# Altium project Project_esp32_kit.PrjPCB
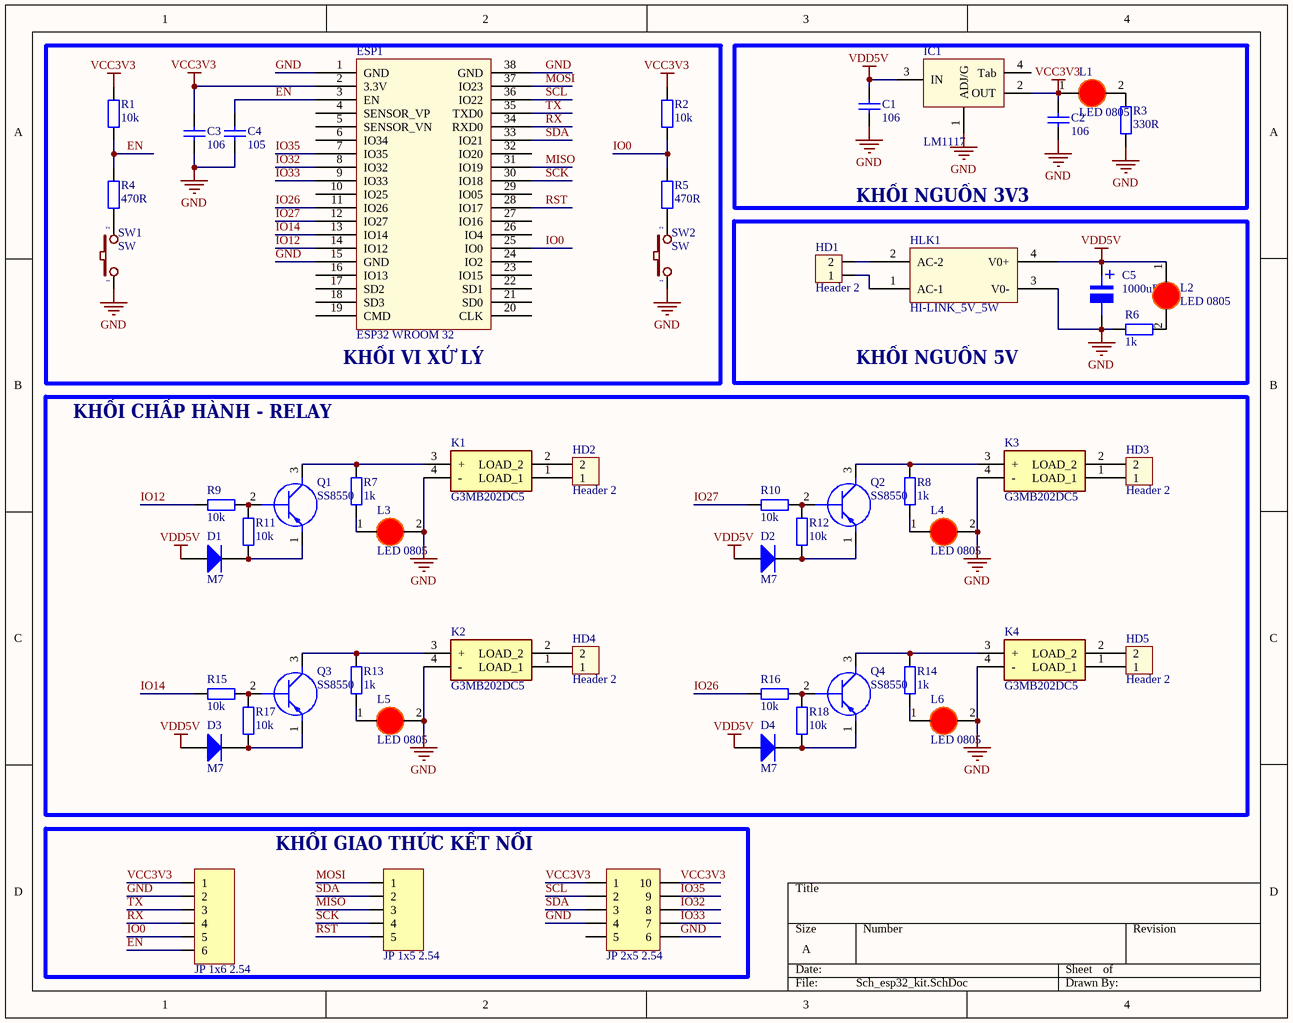
[diagram p0: Sch_esp32_kit.SchDoc]
1 sheet, 54 parts. Net scope: global (net labels, ports and power ports of the same name join across sheets).
Board file: PCB_esp32_kit.PcbDoc

## Sheet Sch_esp32_kit.SchDoc
size A

### Parts
C1  106  [tu 0603]
C2  106  [tu 0603]
C3  106  [tu 0603]
C4  105  [tu 0603]
C5  1000uF  [tu nhom 10 (G)]
D1  M7  [DIODE SMA]
D2  M7  [DIODE SMA]
D3  M7  [DIODE SMA]
D4  M7  [DIODE SMA]
ESP1  ESP32 WROOM 32  [ESP32-WROOM-32D]
HD1  Header 2  [HED2]
HD2  Header 2  [HED2]
HD3  Header 2  [HED2]
HD4  Header 2  [HED2]
HD5  Header 2  [HED2]
HLK1  HI-LINK_5V_5W  [HLK10M05]
IC1  LM1117  [SOT223-4N]
JP1  JP 1x6 2.54  [JP 1x6 DT]
JP2  JP 1x5 2.54  [JP 1x5 DT]
JP3  JP 2x5 2.54  [JP 2x5 DT]
K1  G3MB202DC5  [G3MC-201PL]
K2  G3MB202DC5  [G3MC-201PL]
K3  G3MB202DC5  [G3MC-201PL]
K4  G3MB202DC5  [G3MC-201PL]
L1  LED 0805  [LED-0805-Red]
L2  LED 0805  [LED-0805-Red]
L3  LED 0805  [LED-0805-Red]
L4  LED 0805  [LED-0805-Red]
L5  LED 0805  [LED-0805-Red]
L6  LED 0805  [LED-0805-Red]
Q1  SS8550  [SS8550]
Q2  SS8550  [SS8550]
Q3  SS8550  [SS8550]
Q4  SS8550  [SS8550]
R1  10k  [tro smd 0603]
R2  10k  [tro smd 0603]
R3  330R  [tro smd 0603]
R4  470R  [tro smd 0603]
R5  470R  [tro smd 0603]
R6  1k  [tro smd 0603]
R7  1k  [tro smd 0603]
R8  1k  [tro smd 0603]
R9  10k  [tro smd 0603]
R10  10k  [tro smd 0603]
R11  10k  [tro smd 0603]
R12  10k  [tro smd 0603]
R13  1k  [tro smd 0603]
R14  1k  [tro smd 0603]
R15  10k  [tro smd 0603]
R16  10k  [tro smd 0603]
R17  10k  [tro smd 0603]
R18  10k  [tro smd 0603]
SW1  SW  [SW1-SMD]
SW2  SW  [SW1-SMD]

### Blocks framed on the sheet
KHỐI VI XỬ LÝ: C3 C4 ESP1 R1 R2 R4 R5 SW1 SW2
KHỐI NGUỒN 3V3: C1 C2 IC1 L1 R3
KHỐI NGUỒN 5V: C5 HD1 HLK1 L2 R6
KHỐI CHẤP HÀNH - RELAY: D1-D4 HD2-HD5 K1-K4 L3-L6 Q1-Q4 R7-R18
KHỐI GIAO THỨC KẾT NỐI: JP1-JP3

### Nets
GND: C1.2 C2.2 C3.2 C4.2 C5.2 ESP1.1(GND) ESP1.15(GND) ESP1.38(GND) HLK1.3(V0-) IC1.1(ADJ/G) JP1.2 JP3.4 JP3.6 K1.4(-) K2.4(-) K3.4(-) K4.4(-) L3.2(K) L4.2(K) L5.2(K) L6.2(K) R3.1 R6.1 SW1.1 SW2.1
VCC3V3: C2.1 C3.1 ESP1.2(3.3V) IC1.2(OUT) JP1.1 JP3.1 JP3.10 L1.1(A) R1.2 R2.2
VDD5V: C1.1 C5.1 D1.1(A) D2.1(A) D3.1(A) D4.1(A) HLK1.4(V0+) IC1.3(IN) L2.1(A)
EN: C4.1 ESP1.3(EN) JP1.6 R1.1 R4.2
IO0: ESP1.25(IO0) JP1.5 R2.1 R5.2
IO12: ESP1.14(IO12) R9.2
IO14: ESP1.13(IO14) R15.2
IO26: ESP1.11(IO26) R16.2
IO27: ESP1.12(IO27) R10.2
IO32: ESP1.8(IO32) JP3.8
IO33: ESP1.9(IO33) JP3.7
IO35: ESP1.7(IO35) JP3.9
MISO: ESP1.31(IO19) JP2.3
MOSI: ESP1.37(IO23) JP2.1
RST: ESP1.28(IO17) JP2.5
RX: ESP1.34(RXD0) JP1.4
SCK: ESP1.30(IO18) JP2.4
SCL: ESP1.36(IO22) JP3.2
SDA: ESP1.33(IO21) JP2.2 JP3.3
TX: ESP1.35(TXD0) JP1.3
NetD1_2: D1.2(K) Q1.1(E) R11.1
NetD2_2: D2.2(K) Q2.1(E) R12.1
NetD3_2: D3.2(K) Q3.1(E) R17.1
NetD4_2: D4.2(K) Q4.1(E) R18.1
NetHD1_1: HD1.1 HLK1.1(AC-1)
NetHD1_2: HD1.2 HLK1.2(AC-2)
NetHD2_1: HD2.1 K1.1(LOAD_1)
NetHD2_2: HD2.2 K1.2(LOAD_2)
NetHD3_1: HD3.1 K3.1(LOAD_1)
NetHD3_2: HD3.2 K3.2(LOAD_2)
NetHD4_1: HD4.1 K2.1(LOAD_1)
NetHD4_2: HD4.2 K2.2(LOAD_2)
NetHD5_1: HD5.1 K4.1(LOAD_1)
NetHD5_2: HD5.2 K4.2(LOAD_2)
NetK1_3: K1.3(+) Q1.3(C) R7.2
NetK2_3: K2.3(+) Q3.3(C) R13.2
NetK3_3: K3.3(+) Q2.3(C) R8.2
NetK4_3: K4.3(+) Q4.3(C) R14.2
NetL1_2: L1.2(K) R3.2
NetL2_2: L2.2(K) R6.2
NetL3_1: L3.1(A) R7.1
NetL4_1: L4.1(A) R8.1
NetL5_1: L5.1(A) R13.1
NetL6_1: L6.1(A) R14.1
NetQ1_2: Q1.2(B) R9.1 R11.2
NetQ2_2: Q2.2(B) R10.1 R12.2
NetQ3_2: Q3.2(B) R15.1 R17.2
NetQ4_2: Q4.2(B) R16.1 R18.2
NetR4_1: R4.1 SW1.2
NetR5_1: R5.1 SW2.2

Not connected (* = marked no-connect by the designer): ESP1 4(SENSOR_VP) 5(SENSOR_VN) 6(IO34) 10(IO25) 16(IO13) 17(SD2) 18(SD3) 19(CMD) 20(CLK) 21(SD0) 22(SD1) 23(IO15) 24(IO2) 26(IO4) 27(IO16) 29(IO05) 32(IO20); IC1 4(Tab); JP3 5

### Notes on the sheet
- (in symbol Tu Nhom 1000uF 10V) +

### Library data of the parts
C1-C3 = Tu 0603 106 16V 20%: Dán; Don_Vi: Con; So_Chan: 2; Ten_Linh_Kien: Tụ 0603-10uF 20% 16V; Ma_Hang: MH004848; Chung_Loai: Dán; Kieu_Chan: *
C4 = Tu 0603 105 50V 10%: Dán; Don_Vi: Con; So_Chan: 2; Ten_Linh_Kien: Tụ 0603 105-1uF 50V 10%; Ma_Hang: MH004569; Chung_Loai: Dán; Kieu_Chan: *
C5 = Tu Nhom 1000uF 10V: Dán; So_Chan: 2; Don_Vi: Con; Ten_Linh_Kien: Tụ Nhôm 1000uF 10V; Ma_Hang: MH007515; Chung_Loai: Dán; Kieu_Chan: *
D1-D4 = Diode M7 ( 4007 ): Dán; Don_Vi: Con; Ten_Linh_Kien: Diode M7 1N4007 SMD 1A 1000V; Ma_Hang: MH000944; Chung_Loai: Dán; Ghi_Chu: *
HD1-HD5 = Hed2: Header 2 (Green); Value: Header 2
HLK1 = HI-LINK_5V_5W: Integrated Circuit; Manufacturer_Name: Advanced Monolithic Systems; Manufacturer_Part_Number: ams1117-3.3v; Datasheet Link: http://www.advanced-monolithic.com/pdf/ds1117.pdf; Height: 1.8mm
IC1 = LM1117: 3v3; Value: LM317
JP1 = JP 1x6 2.54 Duc Thang: Cắm; Ten_Linh_Kien: Jump Đơn Đực 2.54MM 1x40P Thẳng 11MM; Don_Vi: Con; Ma_Hang: MH000903; Ghi_Chu: *; Kieu_Chan: *; Chung_Loai: Cắm
JP2 = JP 1x5 2.54 Duc Thang: Cắm; Ten_Linh_Kien: Jump Đơn Đực 2.54MM 1x40P Thẳng 11MM; Don_Vi: Con; Ma_Hang: MH000903; Ghi_Chu: *; Kieu_Chan: *; Chung_Loai: Cắm
JP3 = JP 2x5 2.54 Duc Thang: Cắm; Ten_Linh_Kien: Jump Đôi Đực 2.54MM 2x40P Thẳng 11MM; Don_Vi: Con; Ma_Hang: MH002686; Ghi_Chu: *; Kieu_Chan: *; Chung_Loai: Cắm
K1-K4 = G3MB-202P-DC5_1: Relay or Contactor; Manufacturer_Name: Omron Electronics; Manufacturer_Part_Number: G3MB-202P-4 DC5; Datasheet Link: https://componentsearchengine.com/Datasheets/1/G3MB-202P-4 DC5.pdf; Height: 20.5mm; Mouser Part Number: 653-G3MB-202P4DC5; Mouser Price/Stock: https://www.mouser.co.uk/ProductDetail/Omron-Automation-and-Safety/G3MB-202P-4-DC5?qs=Z0CfnKMjtWg7MIsv3RC0Aw%3D%3D
L1-L6 = LED 0805 Do: Dán; Don_Vi: Con; Ma_Hang: MH000897; Ten_Linh_Kien: LED 0805 Màu Đỏ (Red); Ghi_Chu: *; Kieu_Chan: *; Chung_Loai: Dán
Q1-Q4 = SS8550: Transistor BJT PNP; Manufacturer_Name: Formosa Microsemi; Datasheet Link: https://datasheet.lcsc.com/szlcsc/1903281702_Formosa-Microsemi-SS8550_C341553.pdf; Height: 1.11mm; Manufacturer_Part_Number: SS8550
R1 R2 R9-R12 R15-R18 = Tro 0603 5% 10k: Dán; Don_Vi: Con; So_Chan: 2; Ten_Linh_Kien: Trở 0603 5% 10k; Ma_Hang: MH006316; Chung_Loai: Dán; Kieu_Chan: *
R3 = Tro 0603 5% 330R: Dán; Don_Vi: Con; Ma_Hang: MH006910; So_Chan: 2; Ten_Linh_Kien: Trở 0603 5% 330R; Chung_Loai: Dán; Kieu_Chan: *
R4 R5 = Tro 0603 5% 470R: Dán; Don_Vi: Con; So_Chan: 2; Ten_Linh_Kien: Trở 0603 5% 470R; Ma_Hang: MH006328; Chung_Loai: Dán; Kieu_Chan: *
R6-R8 R13 R14 = Tro 0603 5% 1k: Dán; Don_Vi: Con; So_Chan: 2; Ten_Linh_Kien: Trở 0603 5% 1k; Ma_Hang: MH006319; Chung_Loai: Dán; Kieu_Chan: *
SW1 SW2 = SW2: Switch button 2 pin; Value: SW chip 2 pin